# EAGLE schematic relayProtoType (EAGLE 6.4)
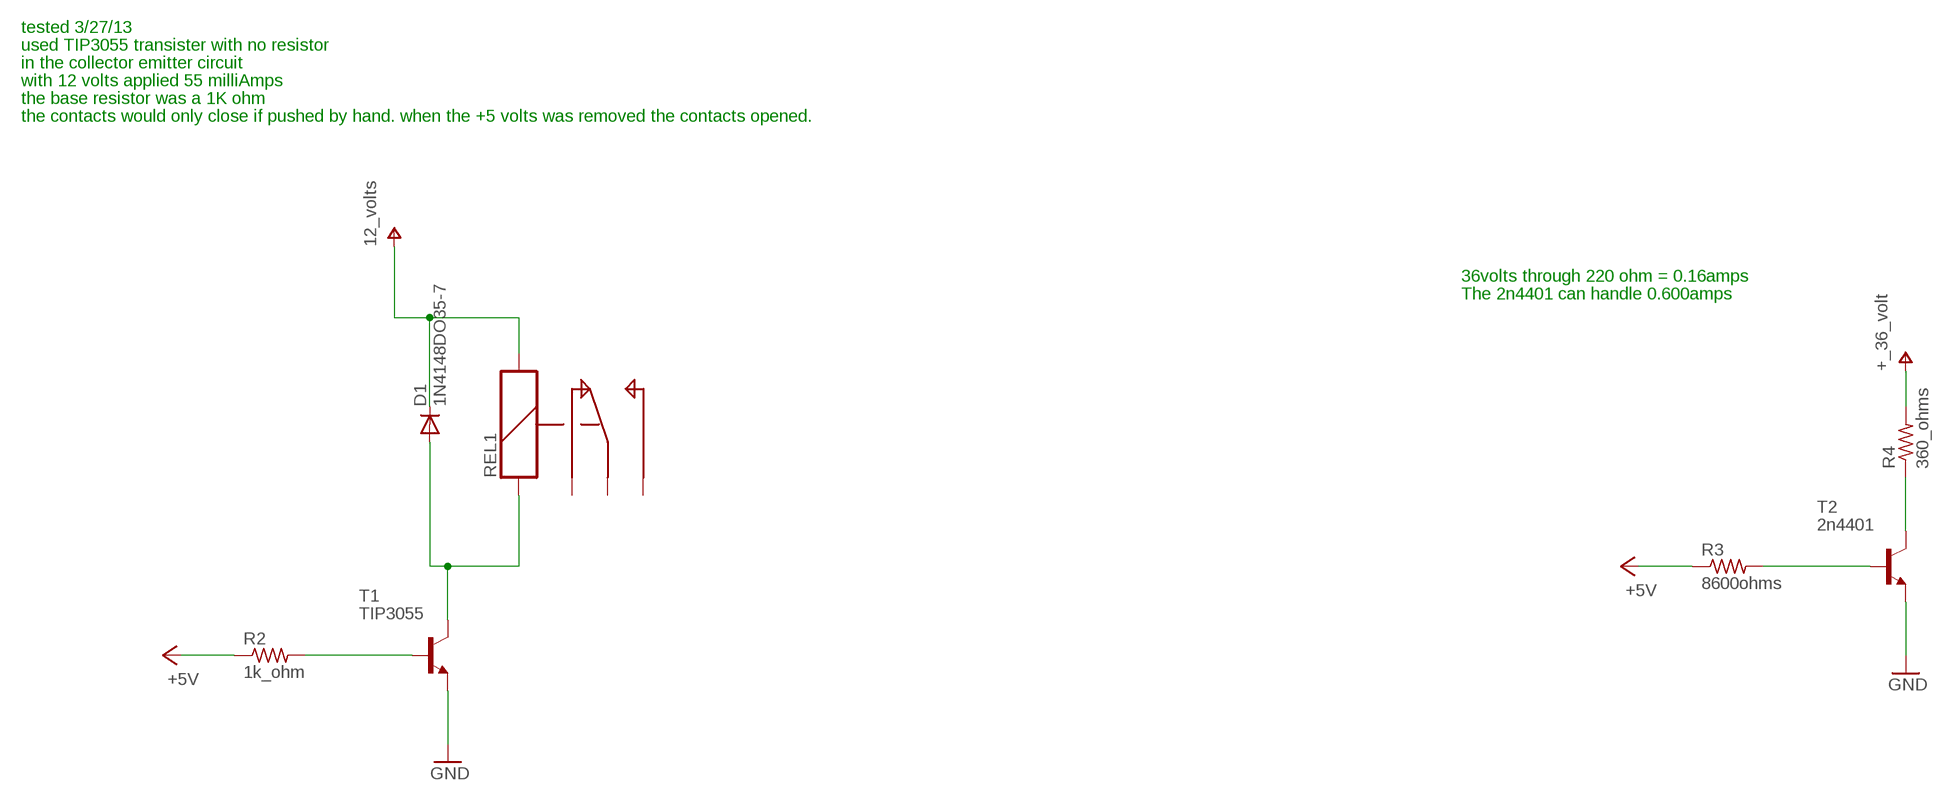
[diagram p0: schematic, sheet 1]

## Parts
D1  1N4148DO35-7  [DO35-7]
R2  1k_ohm  R-US_0207/10  [0207/10]
R3  8600ohms  R-US_0207/10  [0207/10]
R4  360_ohms  R-US_0207/10  [0207/10]
REL1  REL-5PIN  [REL-5PIN]
T1  TIP3055  -NPN-TO92  [TO92]
T2  2n4401  -NPN-TO92  [TO92]

## Nets
+5V: R2.1 R3.1
GND: T1.1(E) T2.1(E)
N$1: R4.1 T2.3(C)
N$3: D1.A REL1.S1 T1.3(C)
N$4: R3.2 T2.2(B)
N$5: R2.2 T1.2(B)
V+: D1.C R4.2 REL1.S2 ; supply symbol labelled 12_volts, +_36_volt
Unconnected: REL1.C REL1.O REL1.S

## Notes on the sheet
- tested 3/27/13
- used TIP3055 transister with no resistor
- in the collector emitter circuit
- with 12 volts applied 55 milliAmps
- the base resistor was a 1K ohm
- the contacts would only close if pushed by hand. when the +5 volts was removed the contacts opened.
- 36volts through 220 ohm = 0.16amps
- The 2n4401 can handle 0.600amps

## Library data of the parts
D1 = diode:1N4148: DIODE high speed (Philips)
R2-R4 = rcl:R-US_: RESISTOR, American symbol
REL1 = special:REL-5PIN: RELAY
T1 T2 = transistor:*-NPN-: NPN Transistror BF959 corrected 2008.03.06